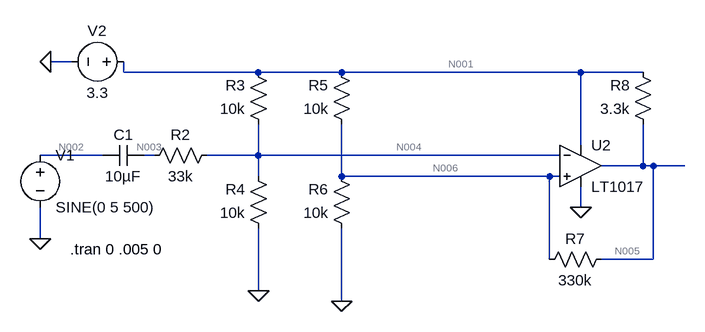
[diagram p0: schematic Sine2Square.asc]
Sine2Square.asc, the LTspice schematic file:
Version 4
SHEET 1 880 680
WIRE -576 16 -608 16
WIRE -496 32 -496 16
WIRE -288 32 -496 32
WIRE -160 32 -288 32
WIRE 208 32 -160 32
WIRE 304 32 208 32
WIRE 208 144 208 32
WIRE -528 160 -624 160
WIRE -448 160 -464 160
WIRE -288 160 -288 112
WIRE -288 160 -368 160
WIRE 176 160 -288 160
WIRE 304 176 304 112
WIRE 304 176 240 176
WIRE 320 176 304 176
WIRE 368 176 320 176
WIRE -288 192 -288 160
WIRE -160 192 -160 112
WIRE 160 192 -160 192
WIRE 176 192 160 192
WIRE 208 240 208 208
WIRE -624 288 -624 240
WIRE 160 320 160 192
WIRE 320 320 320 176
WIRE 320 320 240 320
WIRE -288 368 -288 272
WIRE -160 384 -160 272
FLAG -624 288 0
FLAG 208 240 0
FLAG -608 16 0
FLAG -288 368 0
FLAG -160 384 0
SYMBOL voltage -624 144 R0
WINDOW 123 0 0 Left 0
WINDOW 39 0 0 Left 0
SYMATTR InstName V1
SYMATTR Value SINE(0 5 500)
SYMBOL res -352 144 R90
WINDOW 0 0 56 VBottom 2
WINDOW 3 32 56 VTop 2
SYMATTR InstName R2
SYMATTR Value 33k
SYMBOL res -272 128 R180
WINDOW 0 36 76 Left 2
WINDOW 3 36 40 Left 2
SYMATTR InstName R3
SYMATTR Value 10k
SYMBOL res -272 288 R180
WINDOW 0 36 76 Left 2
WINDOW 3 36 40 Left 2
SYMATTR InstName R4
SYMATTR Value 10k
SYMBOL res -144 128 R180
WINDOW 0 36 76 Left 2
WINDOW 3 36 40 Left 2
SYMATTR InstName R5
SYMATTR Value 10k
SYMBOL res -144 288 R180
WINDOW 0 36 76 Left 2
WINDOW 3 36 40 Left 2
SYMATTR InstName R6
SYMATTR Value 10k
SYMBOL res 256 304 R90
WINDOW 0 0 56 VBottom 2
WINDOW 3 32 56 VTop 2
SYMATTR InstName R7
SYMATTR Value 330k
SYMBOL res 320 128 R180
WINDOW 0 36 76 Left 2
WINDOW 3 36 40 Left 2
SYMATTR InstName R8
SYMATTR Value 3.3k
SYMBOL voltage -480 16 R90
WINDOW 0 -32 56 VBottom 2
WINDOW 3 32 56 VTop 2
WINDOW 123 0 0 Left 0
WINDOW 39 0 0 Left 0
SYMATTR InstName V2
SYMATTR Value 3.3
SYMBOL Comparators\\LT1017 208 176 R0
SYMATTR InstName U2
SYMBOL cap -464 144 R90
WINDOW 0 0 32 VBottom 2
WINDOW 3 32 32 VTop 2
SYMATTR InstName C1
SYMATTR Value 10µF
TEXT -578 304 Left 2 !.tran 0 .005 0

The netlist it stands for:
* Sine2Square.asc
V1 N002 0 SINE(0 5 500)
R2 N004 N003 33k
R3 N004 N001 10k
R4 0 N004 10k
R5 N006 N001 10k
R6 0 N006 10k
R7 N005 N006 330k
R8 N005 N001 3.3k
V2 N001 0 3.3
XU2 N006 N004 N001 0 N005 LT1017  ; pins In+ In- V+ V- OUT
C1 N003 N002 10µF
.tran 0 .005 0
.backanno
.end

* Results of the author's LTspice run, read from the files saved beside the schematic
* Operating Point, zero values left out:
*   V(n004) = 1.65 V
*   V(n003) = 1.65 V
*   V(n001) = 3.3 V
*   V(n006) = 1.626 V
*   V(n005) = 59.27 mV
*   I(R8) = -982 µA
*   I(R7) = -4.748 µA
*   I(R6) = -162.6 µA
*   I(R5) = -167.4 µA
*   I(R4) = -165 µA
*   I(R3) = -165 µA
*   I(V2) = -1.439 mA
*   Ix(u2:1) = 1.972 nA
*   Ix(u2:2) = 4.228 nA
*   Ix(u2:3) = 125.1 µA
*   Ix(u2:4) = -1.112 mA
*   Ix(u2:5) = 986.8 µA
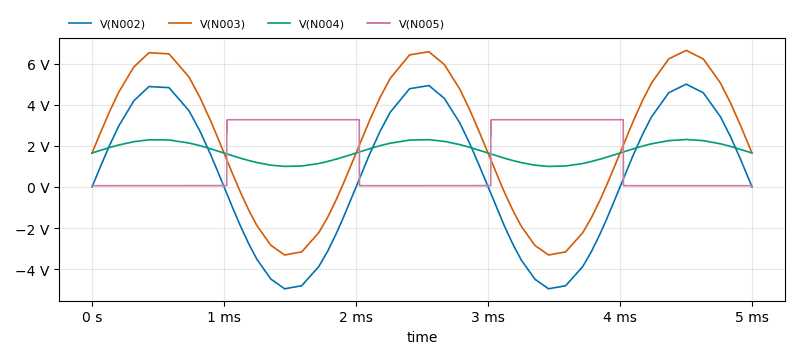
[diagram p1: Transient Analysis of Sine2Square.asc, plotted from the saved traces]
* Transient Analysis, 1 run:
*   V(N002): min -4.959 V, max 5 V, average 624.5 mV, rms 3.508 V, last 0 V
*   V(N003): min -3.313 V, max 6.645 V, average 2.27 V, rms 4.132 V, last 1.642 V
*   V(N004): min 997 mV, max 2.307 V, average 1.732 V, rms 1.79 V, last 1.649 V
*   V(N005): min 59.24 mV, max 3.271 V, average 1.349 V, rms 2.073 V, last 59.27 mV